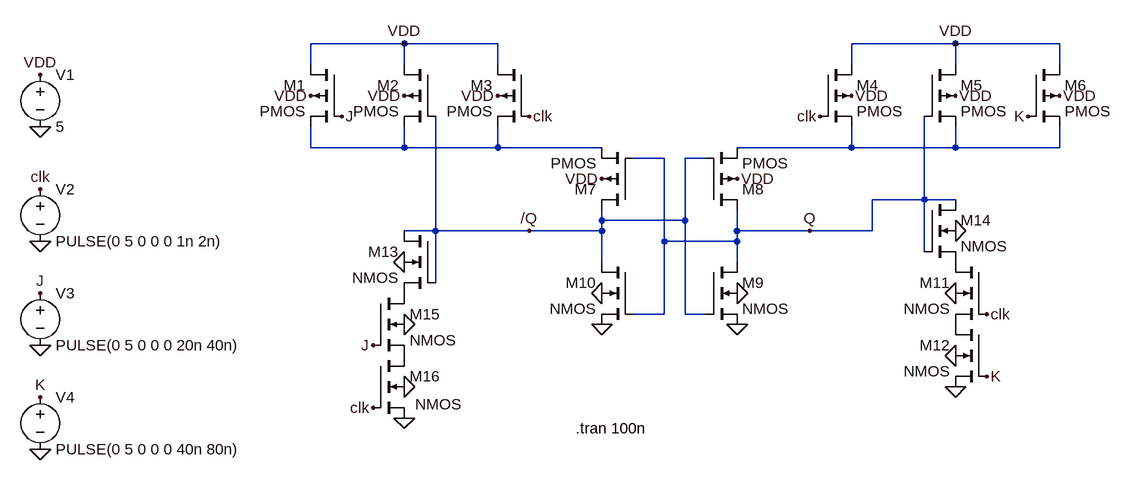
[diagram p0: schematic jk sch.asc]
jk sch.asc, the LTspice schematic file:
Version 4
SHEET 1 1008 680
WIRE -80 -288 -224 -288
WIRE 64 -288 -80 -288
WIRE 768 -288 608 -288
WIRE 928 -288 768 -288
WIRE -224 -256 -224 -288
WIRE -80 -256 -80 -288
WIRE 64 -256 64 -288
WIRE 608 -256 608 -288
WIRE 768 -256 768 -288
WIRE 928 -256 928 -288
WIRE -224 -128 -224 -160
WIRE -80 -128 -80 -160
WIRE -80 -128 -224 -128
WIRE 64 -128 64 -160
WIRE 64 -128 -80 -128
WIRE 224 -128 64 -128
WIRE 608 -128 608 -160
WIRE 608 -128 432 -128
WIRE 768 -128 768 -160
WIRE 768 -128 608 -128
WIRE 928 -128 928 -160
WIRE 928 -128 768 -128
WIRE 320 -112 272 -112
WIRE 384 -112 352 -112
WIRE 720 -48 720 -176
WIRE 720 -48 640 -48
WIRE 768 -48 720 -48
WIRE 224 -16 224 -32
WIRE 352 -16 352 -112
WIRE 352 -16 224 -16
WIRE -32 0 -32 -176
WIRE -32 0 -80 0
WIRE 112 0 -32 0
WIRE 224 0 224 -16
WIRE 224 0 112 0
WIRE 432 0 432 -32
WIRE 544 0 432 0
WIRE 640 0 640 -48
WIRE 640 0 544 0
WIRE 320 16 320 -112
WIRE 432 16 432 0
WIRE 432 16 320 16
WIRE 720 32 720 -48
WIRE 224 48 224 0
WIRE 432 48 432 16
WIRE -32 80 -32 0
WIRE 320 128 320 16
WIRE 320 128 272 128
WIRE 352 128 352 -16
WIRE 384 128 352 128
FLAG 768 240 0
FLAG 768 192 0
FLAG 768 96 0
FLAG 768 0 0
FLAG 432 96 0
FLAG 432 144 0
FLAG 224 144 0
FLAG 224 96 0
FLAG -80 48 0
FLAG -80 144 0
FLAG -80 240 0
FLAG -80 288 0
FLAG -640 -160 0
FLAG -640 16 0
FLAG -640 336 0
FLAG -640 176 0
FLAG -640 -240 VDD
FLAG -224 -208 VDD
FLAG -80 -208 VDD
FLAG -80 -288 VDD
FLAG 64 -208 VDD
FLAG 768 -288 VDD
FLAG 608 -208 VDD
FLAG 768 -208 VDD
FLAG 928 -208 VDD
FLAG 432 -80 VDD
FLAG 224 -80 VDD
FLAG -640 -64 clk
FLAG 112 -176 clk
FLAG 560 -176 clk
FLAG 816 128 clk
FLAG -128 272 clk
FLAG -640 96 J
FLAG -128 176 J
FLAG -176 -176 J
FLAG -640 256 K
FLAG 880 -176 K
FLAG 816 224 K
FLAG 544 0 Q
FLAG 112 0 /Q
SYMBOL voltage -640 -256 R0
SYMATTR InstName V1
SYMATTR Value 5
SYMBOL voltage -640 -80 R0
WINDOW 123 0 0 Left 0
WINDOW 39 0 0 Left 0
SYMATTR InstName V2
SYMATTR Value PULSE(0 5 0 0 0 1n 2n)
SYMBOL voltage -640 80 R0
WINDOW 123 0 0 Left 0
WINDOW 39 0 0 Left 0
SYMATTR InstName V3
SYMATTR Value PULSE(0 5 0 0 0 20n 40n)
SYMBOL voltage -640 240 R0
WINDOW 123 0 0 Left 0
WINDOW 39 0 0 Left 0
SYMATTR InstName V4
SYMATTR Value PULSE(0 5 0 0 0 40n 80n)
SYMBOL pmos4 -176 -256 M0
SYMATTR InstName M1
SYMBOL pmos4 -32 -256 M0
SYMATTR InstName M2
SYMBOL pmos4 112 -256 M0
SYMATTR InstName M3
SYMBOL pmos4 560 -256 R0
SYMATTR InstName M4
SYMBOL pmos4 720 -256 R0
SYMATTR InstName M5
SYMBOL pmos4 880 -256 R0
SYMATTR InstName M6
SYMBOL pmos4 272 -32 R180
SYMATTR InstName M7
SYMBOL pmos4 384 -32 M180
SYMATTR InstName M8
SYMBOL nmos4 384 48 R0
SYMATTR InstName M9
SYMBOL nmos4 816 48 M0
SYMATTR InstName M11
SYMBOL nmos4 816 144 M0
SYMATTR InstName M12
SYMBOL nmos4 -32 0 M0
SYMATTR InstName M13
SYMBOL nmos4 720 -48 R0
SYMATTR InstName M14
SYMBOL nmos4 -128 96 R0
SYMATTR InstName M15
SYMBOL nmos4 -128 192 R0
WINDOW 3 65 75 Left 2
SYMATTR InstName M16
SYMBOL nmos4 272 48 M0
SYMATTR InstName M10
TEXT 184 304 Left 2 !.tran 100n

The netlist it stands for:
* jk sch.asc
V1 VDD 0 5
V2 clk 0 PULSE(0 5 0 0 0 1n 2n)
V3 J 0 PULSE(0 5 0 0 0 20n 40n)
V4 K 0 PULSE(0 5 0 0 0 40n 80n)
M1 VDD J N001 VDD PMOS
M2 VDD /Q N001 VDD PMOS
M3 VDD clk N001 VDD PMOS
M4 VDD clk N002 VDD PMOS
M5 VDD Q N002 VDD PMOS
M6 VDD K N002 VDD PMOS
M7 /Q Q N001 VDD PMOS
M8 Q /Q N002 VDD PMOS
M9 Q /Q 0 0 NMOS
M11 P001 clk P002 0 NMOS
M12 P002 K 0 0 NMOS
M13 /Q /Q P003 0 NMOS
M14 Q Q P001 0 NMOS
M15 P003 J P004 0 NMOS
M16 P004 clk 0 0 NMOS
M10 /Q Q 0 0 NMOS
.model NMOS NMOS
.model PMOS PMOS
.lib standard.mos
.tran 100n
.backanno
.end